# EAGLE schematic mod_temperature (EAGLE 7.5.0)
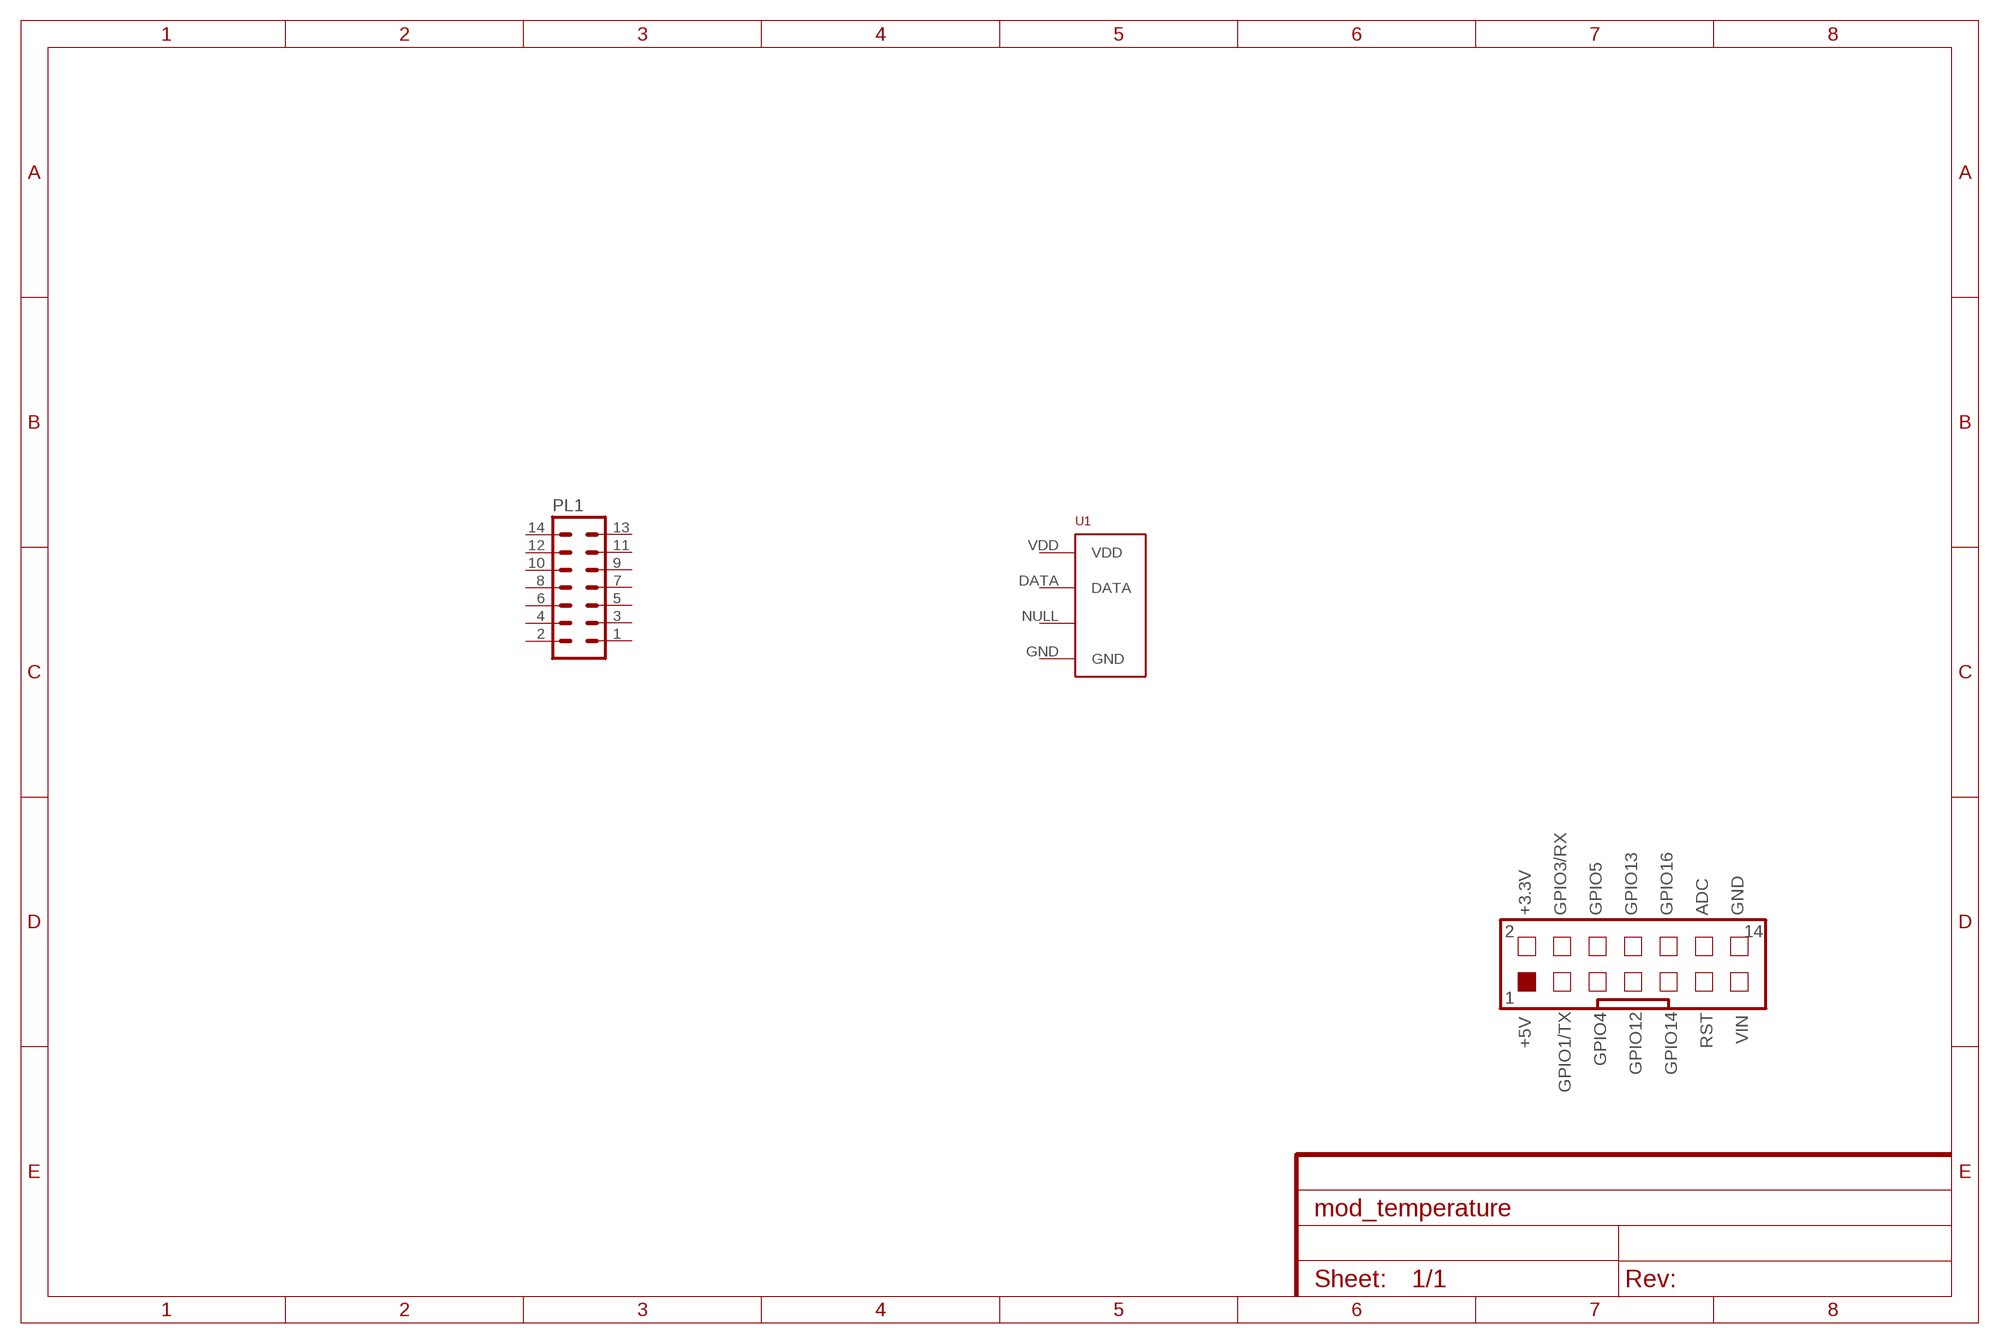
[diagram p0: schematic, sheet 1]
FRAME1 (FRAME-A4L): CNAME: Temperature sensor for IoT Module; CREVISION: 1; DESIGNER: M.Vagovszky

## Parts
PL1  14V  [14V]
U1  RHT03_DHT-22_AM2302RA  [RHT03_DHT-22/RA]
Unconnected: PL1.1 PL1.2 PL1.3 PL1.4 PL1.5 PL1.6 PL1.7 PL1.8 PL1.9 PL1.10 PL1.11 PL1.12 PL1.13 PL1.14 U1.DATA U1.NULL

## Notes on the sheet
- +3.3V | GPIO3/RX | GPIO5 | GPIO13 | GPIO16 | ADC | GND
- 2 | 14
- 1
- +5V | RST | VIN
- GPIO4
- GPIO12 | GPIO14
- GPIO1/TX

## Power pins joined to a net without a drawn wire
GND: U1.GND
VDD: U1.VDD

## Library data of the parts
PL1 = con-harting-v:14V: CONNECTOR; OC_FARNELL: unknown; OC_NEWARK: unknown
U1 = RHT03_DHT-22_AM2302:RHT03_DHT-22_AM2302: RHT03 / DHT-22 / AM2302 Packages and symbol for the RHT03 / DHT-22 relative humidity and temperature sensor. Note: The AM2302 is a wired version of the DHT-22 which typically requires less clearance and is thus provided as a separate package.; PROD_ID: SEN-10167